# EasyEDA Pro project smart-car-main-board.eprj

# Schematic Schematic1
Board Name: Board1; Create Date: 2025-09-15; Page Name: P1; Project Name: 1; Schematic Name: Schematic1; Update Date: 2025-09-16; Company: 嘉立创EDA; Page Size: A4; Version: V1.0
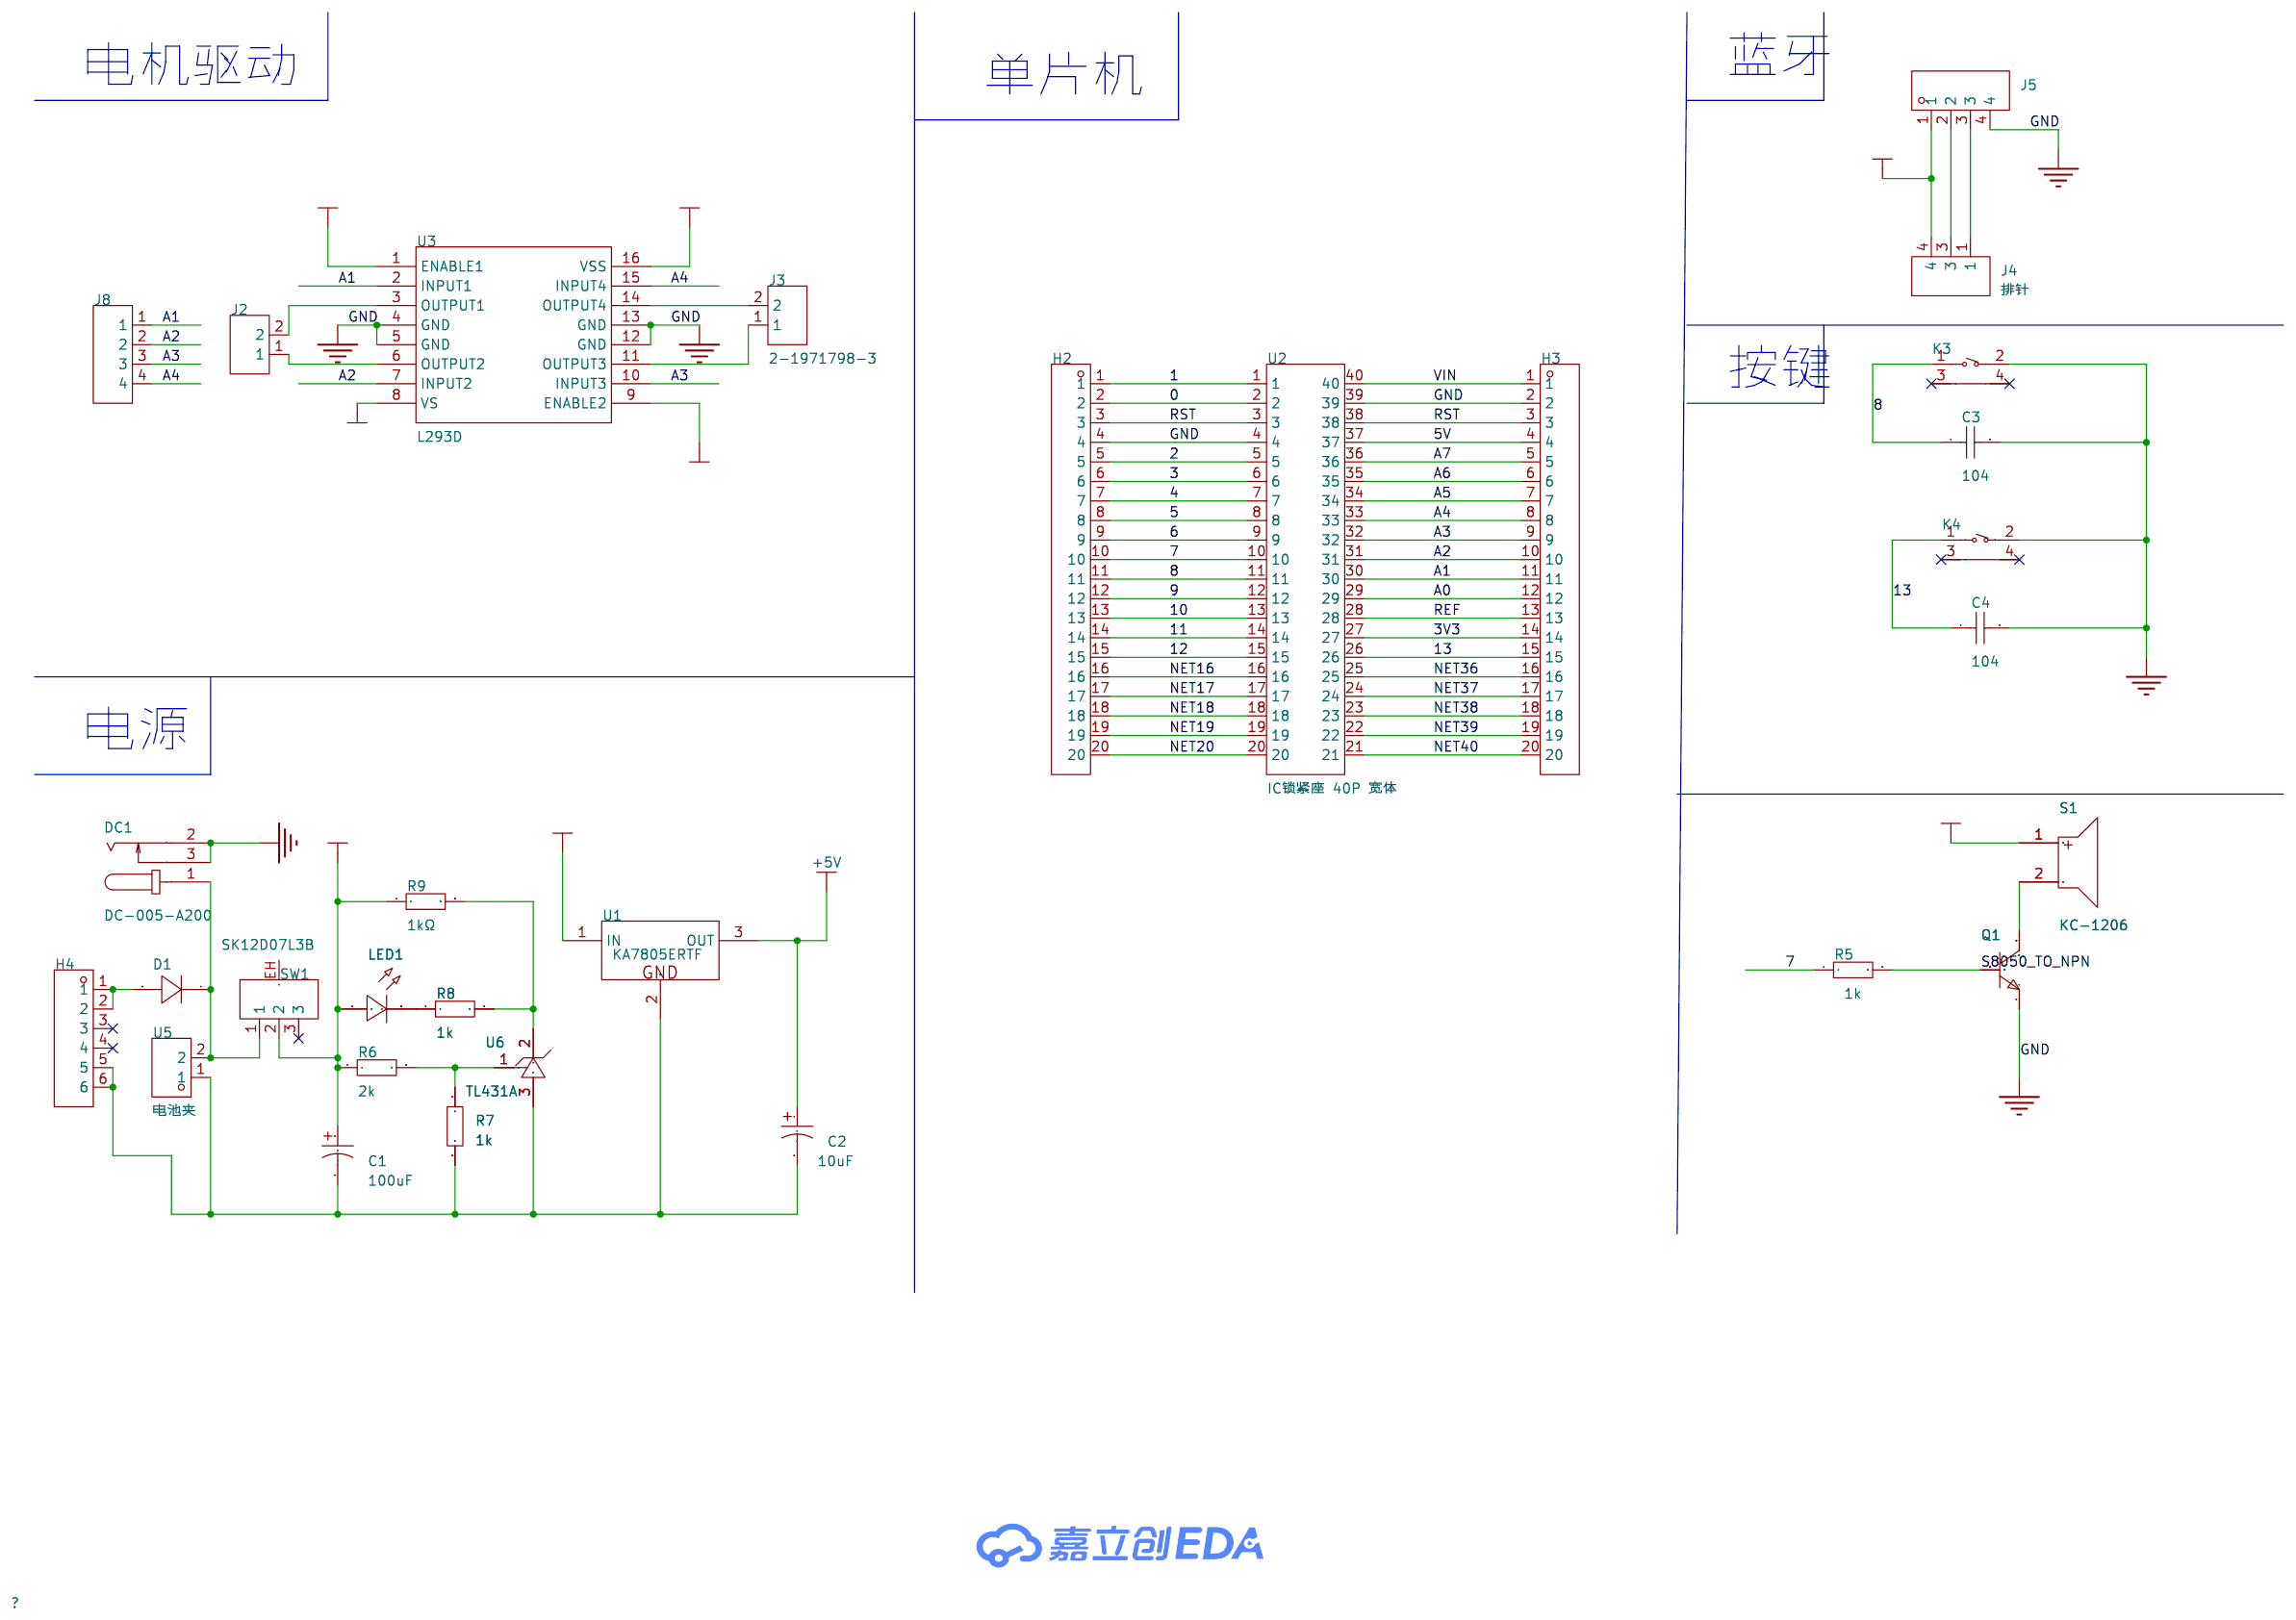
[diagram p0: schematic sheet]

## Parts
C1  100uF  [CAP-D5.0×F2.0]
C2  10uF  [CAP-D5.0×F2.0]
C3  104  [C-0.1]
C4  104  [C-0.1]
D1  -  [DO_1N4007]
DC1  DC-005-A200  [DC-IN-TH_DC-005-A200]
H2  -  [HDR-TH_20P-P2.54-V-M-1]
H3  -  [HDR-TH_20P-P2.54-V-M-1]
H4  -  [HDR-TH_6P-P2.54-V-F]
J2  2-1971798-3  [CONN-TH_2P-P5.08]
J3  2-1971798-3  [CONN-TH_2P-P5.08]
J4  排针  [HDR-TH_3P-P2.54-V-M_H254-1X3P]
J5  -  [HDR-TH_4P-P2.54-V-F]
J8  -  [HDR-TH_4P-P2.54-V-M]
K3  TC-6615-5-260G  [SW-TH_4P-L7.5-W5.0-P4.50]
K4  TC-6615-5-260G  [SW-TH_4P-L7.5-W5.0-P4.50]
LED1  -  [LED_TH-3mm]
Q1  -  [NPN（8050）]
R5  1k  [R_AXIAL-0.3]
R6  2k  [R_AXIAL-0.3]
R7  1k  [R_AXIAL-0.3]
R8  1k  [R_AXIAL-0.3]
R9  1kΩ  [R_AXIAL-0.3]
S1  KC-1206  [BUZ-TH_BD12.0-P6.50-D0.6-FD]
SW1  SK12D07L3B  [SW-TH_SK-12D07-X-X]
U1  KA7805ERTF  [7805]
U2  IC锁紧座 40P 宽体  [CONN-TH_40P-P2.54-V-R2-C20-S15.24-1]
U3  L293D  [DIP-16_L20.0-W6.4-P2.54-LS7.6-BL]
U5  电池夹  [CONN-TH_2P-P5.08]
U6  TL431A  [TO-92-3_L4.9-W3.7-P2.54-L-A]

## Library data of the parts
C1 C2 = CAP POL1: Published: 8-Jun-2000; LatestRevisionDate: 17-Jul-2002; LatestRevisionNote: Re-released for DXP Platform.; PackageReference: RB7.6-15; Publisher: Altium Limited; Comment: Cap Pol1
C3 C4 = CAP: Published: 8-Jun-2000; LatestRevisionDate: 17-Jul-2002; LatestRevisionNote: Re-released for DXP Platform.; PackageReference: RAD-0.3; Publisher: Altium Limited; Comment: Cap
D1 = D_1N4007A: Supplier Footprint: DO-41
DC1 = DC-005-A200: LCSC Part Name: DC电源插座 内径:2mm 外径:6.4mm; Supplier Part: C720557; Manufacturer: XUNPU(讯普); Supplier Footprint: 插件; Datasheet: https://item.szlcsc.com/datasheet/DC-005-A200/763564.html; Supplier: LCSC; Connector Type: DC电源插座; Mounting Type: 弯插; Inside Contact Diameter: 2mm; Outside Contact Diameter: 6.4mm; Current Rating: 3A; Voltage Rating (Max): 30V; Operating Temperature: -20℃~+70℃
H2 H3 = HDR-M_2.54_1x20P: Supplier Part: C50981; Supplier Footprint: 插件; JLCPCB Part Class: 扩展库
H4 = HDR-F_2.54_1x6P: Supplier Part: C40877; Supplier Footprint: 插件
J2 J3 = 2-1971798-3: Supplier Part: C9900011099; Supplier Footprint: DIP-1X2P-2.54MM(5.08X5.08); JLCPCB Part Class: 扩展库; Supplier: LCSC
J4 = H254-1X4P-P2NC-PA4-PS5-PB8-L17MM: Supplier Part: C9900152088; Supplier Footprint: 插件,P=2.54mm; JLCPCB Part Class: 扩展库; Supplier: LCSC
J5 = HDR-F_2.54_1x4P: Supplier Part: C2718488; Supplier Footprint: 插件
J8 = HDR-M_2.54_1x4P: Supplier Part: C492403; Supplier Footprint: 插件; JLCPCB Part Class: 扩展库
K3 K4 = TC-6615-5-260G: LCSC Part Name: 轻触6*6*5支架 插件260g; Supplier Part: C2845270; Manufacturer: HCTL(华灿天禄); Supplier Footprint: 插件; JLCPCB Part Class: 扩展库; Datasheet: https://atta.szlcsc.com/upload/public/pdf/source/20230523/3B07ECEFF69432C539FEAF1B55455C52.pdf; Supplier: LCSC; Circuit: 单刀单掷; Operating Force: 260gf; Mounting Style: 卧插; Switch Length: 6mm; Switch Width: 6mm; Switch Height: 5mm; Strike Gundam: 带支架; Contact Current: 50mA; Voltage Rating (DC): 12V
LED1 = LED_TH-R_3mm: Supplier Footprint: 插件
Q1 = S8050_TO_NPN: Supplier Footprint: TO-92
R5-R9 = Res_0603: Supplier Footprint: 0603
S1 = KC1206 16Ω: LCSC Part Name: 无源电磁式蜂鸣器; Supplier Part: C781869; Manufacturer: YUEXIN(悦馨); Supplier Footprint: 插件,D=12mm; JLCPCB Part Class: 扩展库; Datasheet: https://atta.szlcsc.com/upload/public/pdf/source/20200925/C781869_E6B371E803641AB17D3A1F9F38351C16.pdf; Supplier: LCSC; Driver Circuitry: 无源(外部驱动); Technology: 电磁式; Voltage - Supply: 1V~4V; Current Consumption: 30mA; Sound Pressure Level(SPL): 85dB; Diameter(φD): 12mm; Height: 10mm; Operating Temperature: -20℃~+85℃
SW1 = SK12D07L3B: LCSC Part Name: 2档侧拨可过回流焊手感极佳抗腐蚀24小时柄高3MM拨动开关SK-12D07-L3-B; Supplier Part: C480339; Manufacturer: XKB Connection(中国星坤); Supplier Footprint: 插件; JLCPCB Part Class: 扩展库; Datasheet: https://item.szlcsc.com/datasheet/SK12D07L3B/487802.html; Supplier: LCSC; Circuit: 单刀双掷; Actuator Style: 矩形柱状; Termination Style: PC引脚; Length: 8.6mm; Width: 4.5mm; Switch Height: 4.7mm; Actuator Color: 黑色; Current Rating: 300mA; Voltage Rating: 50V; Life: 1万次; Operating Temperature: -40℃~+85℃
U1 = KA7805ERTF: Supplier Part: C184462; Supplier Footprint: TO-252-2(DPAK); JLCPCB Part Class: 扩展库; Supplier: LCSC
U2 = IC锁紧座 40P 宽体: Supplier Part: C9900004833; Supplier Footprint: 插件; JLCPCB Part Class: 扩展库; Supplier: LCSC
U3 = L293D: LCSC Part Name: 600mA 有刷直流电机驱动芯片 36V; Supplier Part: C12340; Manufacturer: ST(意法半导体); Supplier Footprint: DIP-16; JLCPCB Part Class: 扩展库; Datasheet: https://atta.szlcsc.com/upload/public/pdf/source/20140724/1457707157802.pdf; Supplier: LCSC
U5 = KF2EDGK-5.08-2P: Supplier Part: C9900089420; Supplier Footprint: CONN-TH_2P-P5.08_DB2EVC-5.08-2P; JLCPCB Part Class: 扩展库; Supplier: LCSC
U6 = TL431A: Supplier Part: C411753; Manufacturer: PJSEMI(平晶微); Supplier Footprint: SOT-23; JLCPCB Part Class: 扩展库; Datasheet: https://atta.szlcsc.com/upload/public/pdf/source/20190819/C411753_12F949F6FF6688FC09D63250AB28F55F.pdf; Supplier: LCSC; Output Type: 可调; Voltage - Supply: 37V; Output Voltage: 2.495V~36V; Output Current: 100mA; Minimum Cathode Current for Regulation: 1mA

## Nets
3V3: H3.14 J4.4 J5.1 U2.27
5V: H3.4 U2.37
+5V: C2.1 U1.3(OUT)
+VCC: C1.1 LED1.1(C) R6.1 R9.1 SW1.2 U1.1(IN) U3.8(VS)
GND: C3.2 C4.2 DC1.2 DC1.3 H2.4 H3.2 J5.4 K3.2 K4.2 Q1.1(E) U2.4 U2.39 U3.4(GND) U3.5(GND) U3.12(GND) U3.13(GND)
VIN: H3.1 U2.40
0: H2.2 U2.2
1: H2.1 U2.1
2: H2.5 U2.5
3: H2.6 U2.6
4: H2.7 U2.7
5: H2.8 U2.8
6: H2.9 U2.9
7: H2.10 R5.1 U2.10
8: C3.1 H2.11 K3.1 U2.11
9: H2.12 U2.12
10: H2.13 U2.13
11: H2.14 U2.14
12: H2.15 U2.15
13: C4.1 H3.15 K4.1 U2.26
+5: S1.1 U3.1(ENABLE1) U3.9(ENABLE2) U3.16(VSS)
A0: H3.12 U2.29
A1: H3.11 J8.1 U2.30 U3.2(INPUT1)
A2: H3.10 J8.2 U2.31 U3.7(INPUT2)
A3: H3.9 J8.3 U2.32 U3.10(INPUT3)
A4: H3.8 J8.4 U2.33 U3.15(INPUT4)
A5: H3.7 U2.34
A6: H3.6 U2.35
A7: H3.5 U2.36
NET16: H2.16 U2.16
NET17: H2.17 U2.17
NET18: H2.18 U2.18
NET19: H2.19 U2.19
NET20: H2.20 U2.20
NET36: H3.16 U2.25
NET37: H3.17 U2.24
NET38: H3.18 U2.23
NET39: H3.19 U2.22
NET40: H3.20 U2.21
REF: H3.13 U2.28
RST: H2.3 H3.3 U2.3 U2.38
S8050_TO_NPN: Q1.2(B) R5.2
$1N1657: J2.1 U3.6(OUTPUT2)
$1N1660: J2.2 U3.3(OUTPUT1)
$1N3874: J4.1 J5.3
$1N4302: Q1.3(C) S1.2
Net-(C1-2): C1.2 C2.2 H4.5 H4.6 R7.1 U1.2(GND) U5.1 U6.3(A)
Net-(D1-1): D1.1(K) DC1.1 SW1.1 U5.2
Net-(D1-2): D1.2(A) H4.1 H4.2
Net-(J3-1): J3.1 U3.11(OUTPUT3)
Net-(J3-2): J3.2 U3.14(OUTPUT4)
Net-(J4-3): J4.3 J5.2
Net-(LED1-2): LED1.2(A) R8.1
Net-(R6-2): R6.2 R7.2 U6.1(R)
Net-(R8-2): R8.2 R9.2 U6.2(K)

Not connected (* = marked no-connect by the designer): H4 3* 4*; K3 3* 4*; K4 3* 4*; SW1 3* EH

## Notes on the sheet
- 电机驱动
- 蓝牙
- 单片机
- 按键
- 电源

# Board PCB1
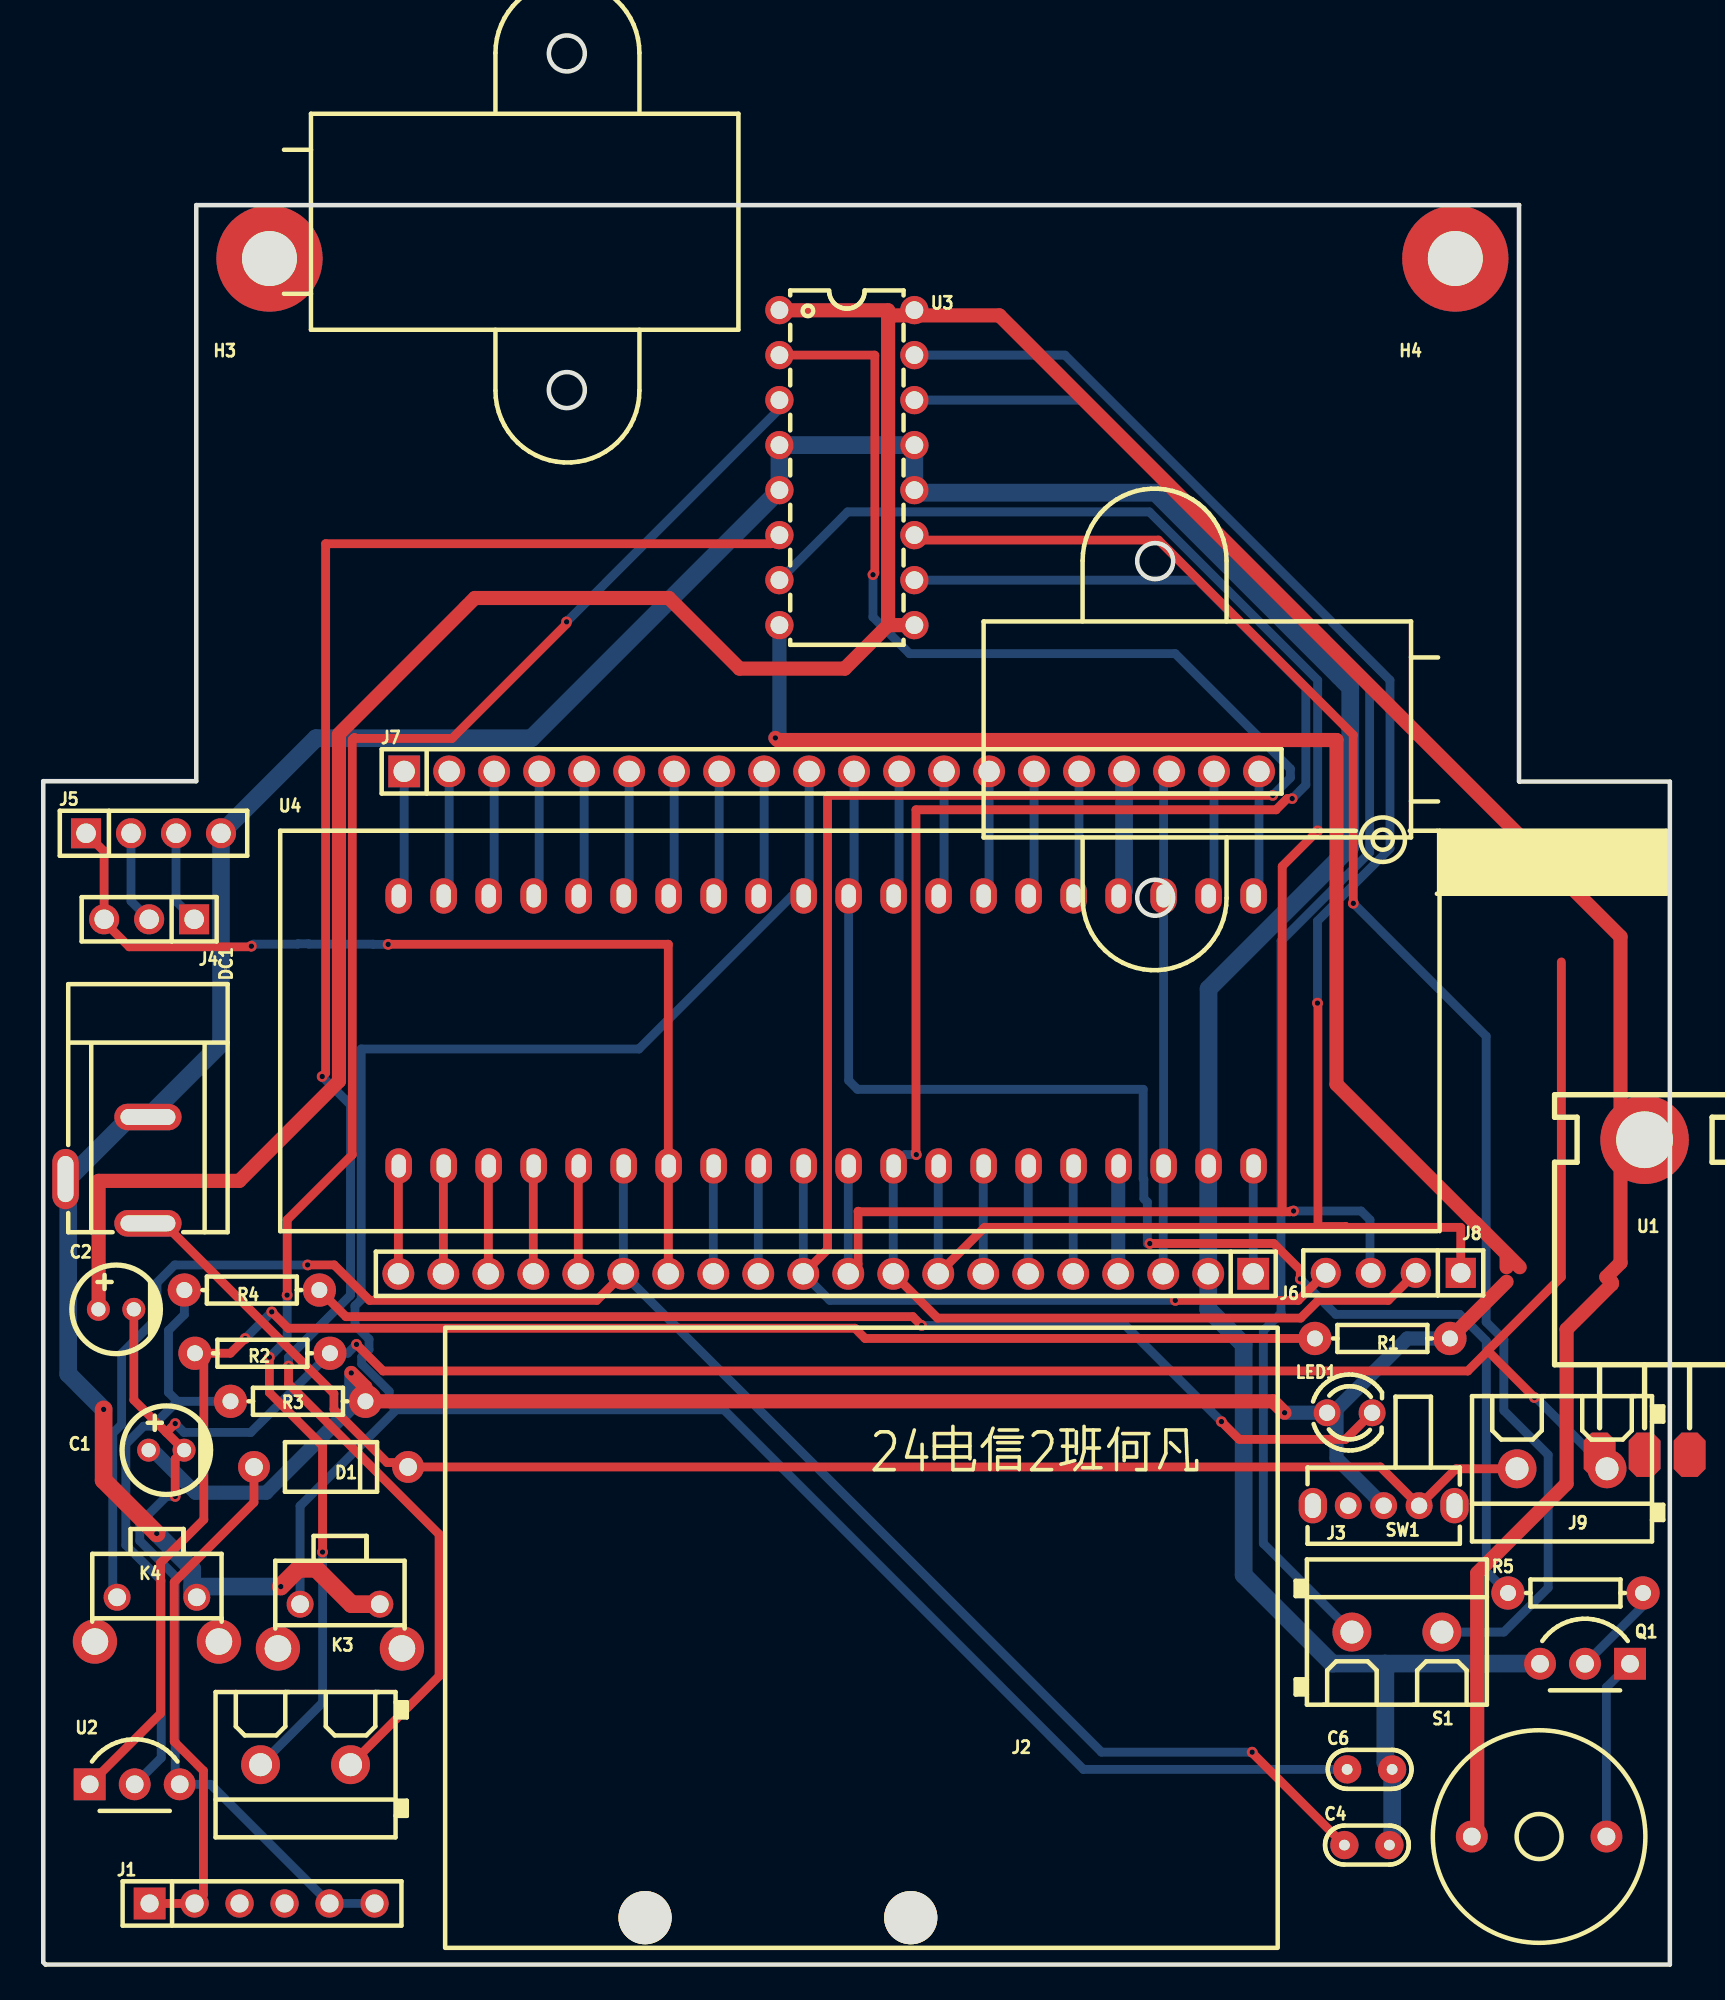
[diagram p1: board, top side]
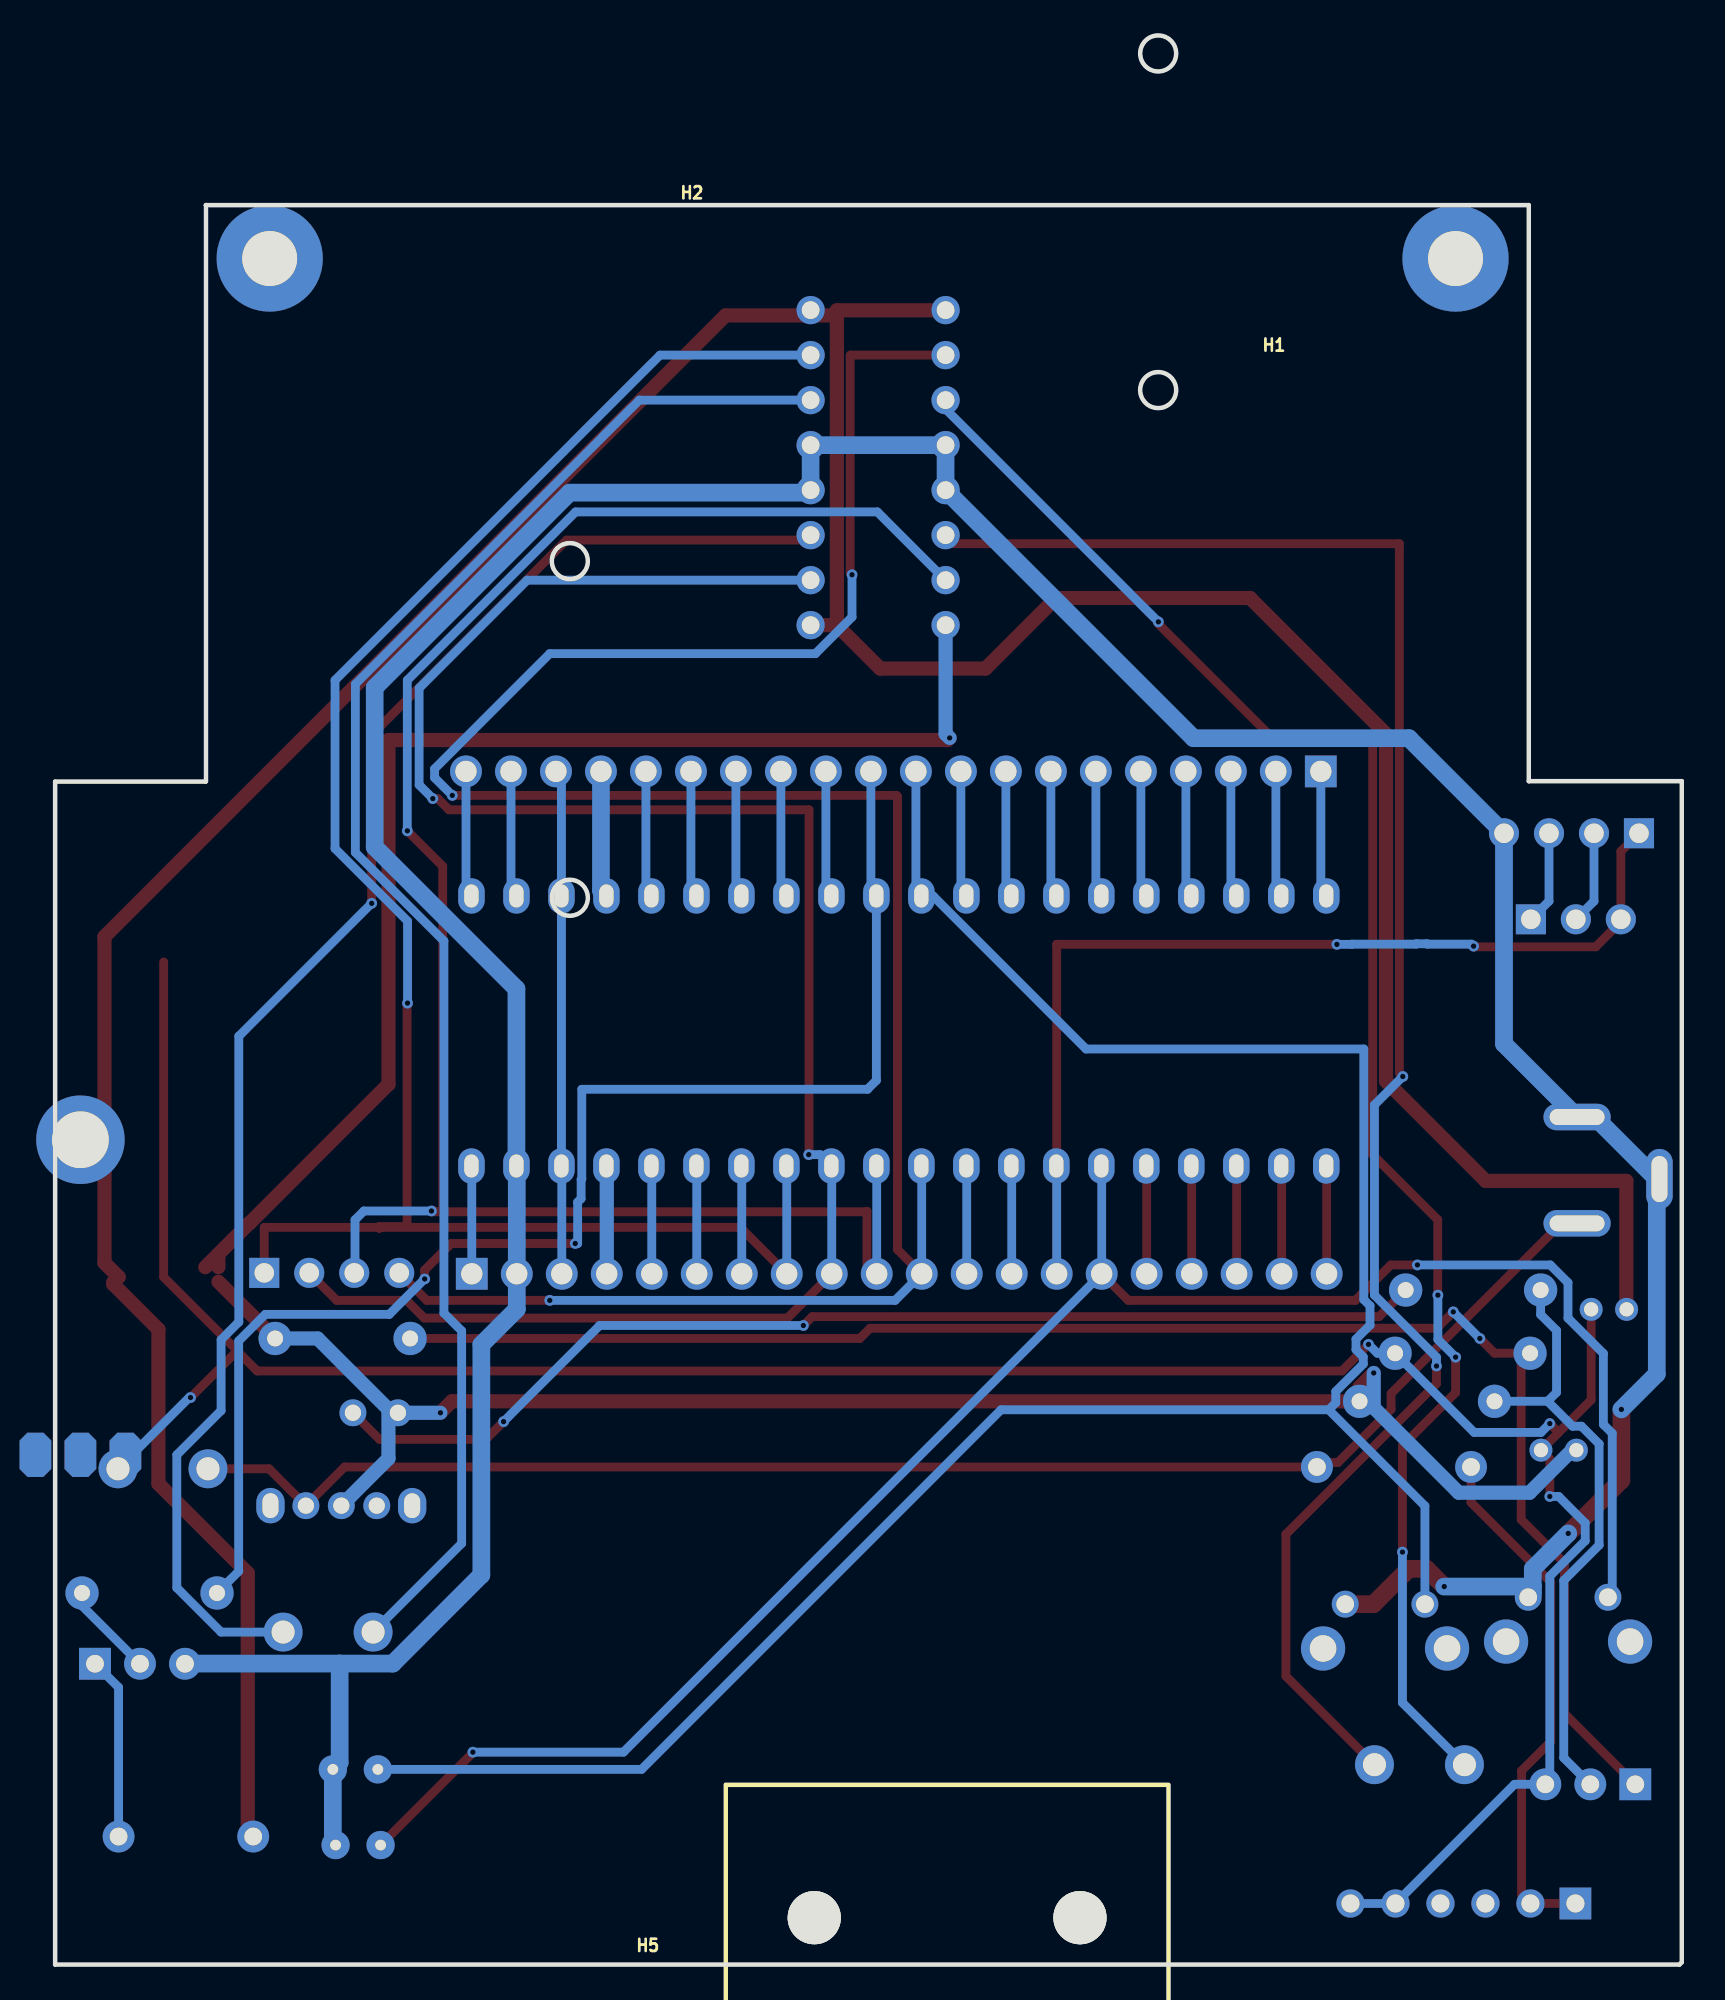
[diagram p2: board, bottom side, seen from below]

Outline 91.83 x 108.88 mm; copper layers: Top Layer, Bottom Layer. Coordinates in mm from the lower left corner of the outline.
Outline path: 0,66.79 0,0.13 0.13,0 91.83,0 91.83,66.76 83.34,66.76 83.31,66.79 83.31,99.3 8.64,99.3 8.64,66.79 0,66.79
Stack: Top Layer 0.035mm / Dielectric1 1.51mm FR4 er 4.5 / Bottom Layer 0.035mm

## Design rules (mm)
template: 自定义配置
spacing copperThickness1oz (default): track to track 0.102, other pairs 0.152 to 0.3
spacing copperThickness2oz: track to track 0.203, other pairs 0.152 to 0.3
track width copperThickness1oz: min 0.127, default 0.254, max 2.54
track width copperThickness2oz: min 0.203, default 0.254, max 2.54
track width 1 (default): min 0.127, default 0.5, max 2.54
track width VCC: min 0.127, default 0.8, max 2.54
track width gnd: min 0.127, default 1, max 2.54
differential pair differentialPair (default): width min 0.127, default 0.254, max 2.54; gap min 0.152, default 0.152
via viaSize (default): diameter min 0.5, default 0.61, max 10; hole min 0.3, default 0.305, max 6.3
net +5 uses VCC
net GND uses gnd
net 5V uses VCC
net GNO uses gnd
net +VCC uses VCC

## Placement (name value [footprint] x y rotation side)
C1  100uF  [CAP-D5.0-F2.0]  6.95 29.03 0 top
C2  10uF  [CAP-D5.0-F2.0]  4.11 36.98 0 top
C4  104  [C-0.1]  73.45 6.74 0 top
C6  104  [C-0.1]  73.61 11.02 0 top
D1  IN4007  [DO_1N4007]  16.25 28.08 180 top
DC1  DC-005-A200  [DC-IN-TH_DC-005-A200]  3.58 44.83 270 top
H1  -  [DJ]  25.91 93.53 180 bottom
H2  -  [DJ]  66.42 74.53 0 bottom
H3  -  [HOLE]  12.52 95.52 0 top
H4  -  [HOLE]  79.46 95.52 0 top
H5  -  [WXL]  53.97 10.15 180 bottom
J1  -  [HDR-TH_6P-P2.54-V-F]  12.35 3.45 0 top
J2  2-1971798-3  [CONN-TH_2P-P5.08]  14.81 11.28 180 top
J3  2-1971798-3  [CONN-TH_2P-P5.08]  76.42 18.77 0 top
J4  排针  [HDR-TH_3P-P2.54-V-M]  5.98 58.99 180 top
J5  -  [HDR-TH_4P-P2.54-V-F]  6.22 63.85 0 top
J6  -  [HDR-TH_20P-P2.54-V-M-1]  44.18 38.99 180 top
J7  -  [HDR-TH_20P-P2.54-V-M-1]  44.5 67.34 0 top
J8  -  [HDR-TH_4P-P2.54-V-M]  76.21 39.04 180 top
J9  -  [CONN-TH_2P-P5.08]  85.74 27.98 180 top
K3  TC-6615-5-260G  [SW-TH_4P-L7.5-W5.0-P4.50]  16.75 19.09 0 top
K4  TC-6615-5-260G  [SW-TH_4P-L7.5-W5.0-P4.50]  6.42 19.48 0 top
LED1  -  [LED_TH-3mm]  73.75 31.14 0 top
Q1  S8050_TO_NPN  [NPN（8050）]  87.04 16.98 0 top
R1  2kΩ  [R_AXIAL-0.3]  75.6 35.34 180 top
R2  1kΩ  [R_AXIAL-0.3]  12.37 34.5 180 top
R3  1kΩ  [R_AXIAL-0.3]  14.38 31.79 180 top
R4  1kΩ  [R_AXIAL-0.3]  11.78 38.07 180 top
R5  1k  [R_AXIAL-0.3]  86.5 20.97 0 top
S1  KC-1206  [BUZ-TH_BD12.0-P7.60-D0.6-FD]  84.45 7.23 0 top
SW1  SK12D07L3B  [SW-TH_SK-12D07-X-X]  75.67 25.9 180 top
U1  KA7805ERTF  [7805]  83.16 38.8 0 top
U2  IC锁紧座 40P 宽体  [TO-92-3_L4.9-W3.7-P2.54-L-A]  5.16 10.17 0 top
U3  L293D  [DIP-16_L20.0-W6.4-P2.54-LS7.6-BL]  45.37 84.48 270 top
U4  IC锁紧座 40P 宽体  [CONN-TH_40P-P2.54-V-R2-C20-S15.24-1]  44.2 52.69 0 top

## Footprints (pads in the part's own frame, mm; a bottom-side part is the same pattern mirrored in y, then rotated)
7805
  custom 1.8x2.5 hole 1: 1(4.699,-10.033) 2(7.239,-10.033) 3(9.779,-10.033)
  round 5 hole 3.2: 2(7.239,7.747)
BUZ-TH_BD12.0-P7.60-D0.6-FD
  round 1.8 hole 1: 1(-3.8,0) 2(3.8,0)
C-0.1
  round 1.6 hole 0.605x0.6: 1(0,0) 2(2.54,0)
CAP-D5.0-F2.0
  round 1.3 hole 0.8: 1(-1,0) 2(1,0)
CONN-TH_2P-P5.08
  round 2.2 hole 1.3: 1(-2.54,0) 2(2.54,0)
CONN-TH_40P-P2.54-V-R2-C20-S15.24-1
  oval 1.5x2 hole 0.8x1.3: 1(24.13,7.62) 2(21.59,7.62) 3(19.05,7.62) 4(16.51,7.62) 5(13.97,7.62) 6(11.43,7.62) 7(8.89,7.62) 8(6.35,7.62) 9(3.81,7.62) 10(1.27,7.62) 11(-1.27,7.62) 12(-3.81,7.62) 13(-6.35,7.62) 14(-8.89,7.62) 15(-11.43,7.62) 16(-13.97,7.62) 17(-16.51,7.62) 18(-19.05,7.62) 19(-21.59,7.62) 20(-24.13,7.62) 21(-24.13,-7.62) 22(-21.59,-7.62) 23(-19.05,-7.62) 24(-16.51,-7.62) 25(-13.97,-7.62) 26(-11.43,-7.62) 27(-8.89,-7.62) 28(-6.35,-7.62) 29(-3.81,-7.62) 30(-1.27,-7.62) 31(1.27,-7.62) 32(3.81,-7.62) 33(6.35,-7.62) 34(8.89,-7.62) 35(11.43,-7.62) 36(13.97,-7.62) 37(16.51,-7.62) 38(19.05,-7.62) 39(21.59,-7.62) 40(24.13,-7.62)
DC-IN-TH_DC-005-A200
  oval 1.5x3.8 hole 0.9x3.1: 1(3,2.325) 2(-3,2.325)
  oval 3.4x1.5 hole 2.6x0.9: 3(0.5,-2.325)
DIP-16_L20.0-W6.4-P2.54-LS7.6-BL
  round 1.6 hole 1: 1(-8.89,-3.81) 2(-6.35,-3.81) 3(-3.81,-3.81) 4(-1.27,-3.81) 5(1.27,-3.81) 6(3.81,-3.81) 7(6.35,-3.81) 8(8.89,-3.81) 9(8.89,3.81) 10(6.35,3.81) 11(3.81,3.81) 12(1.27,3.81) 13(-1.27,3.81) 14(-3.81,3.81) 15(-6.35,3.81) 16(-8.89,3.81)
DJ
  round 0.003 hole 2.032: 1(-3.649,14.326) 2(-3.649,-4.674)
DO_1N4007
  round 1.8 hole 1: 1(-4.35,0) 2(4.35,0)
HDR-TH_3P-P2.54-V-M
  rect 1.7x1.7 hole 1.1: 1(-2.54,0)
  round 1.7 hole 1.1: 2(0,0) 3(2.54,0)
HDR-TH_4P-P2.54-V-F
  rect 1.7x1.7 hole 1.1: 1(-3.81,0)
  round 1.7 hole 1.1: 2(-1.27,0) 3(1.27,0) 4(3.81,0)
HDR-TH_4P-P2.54-V-M
  rect 1.7x1.7 hole 1.1: 1(-3.81,0)
  round 1.7 hole 1.1: 2(-1.27,0) 3(1.27,0) 4(3.81,0)
HDR-TH_6P-P2.54-V-F
  rect 1.8x1.8 hole 1.02: 1(-6.35,0)
  round 1.6 hole 1.02: 2(-3.81,0) 3(-1.27,0) 4(1.27,0) 5(3.81,0) 6(6.35,0)
HDR-TH_20P-P2.54-V-M-1
  rect 1.8x1.8 hole 1.2: 1(-24.13,0)
  round 1.8 hole 1.2: 2(-21.59,0) 3(-19.05,0) 4(-16.51,0) 5(-13.97,0) 6(-11.43,0) 7(-8.89,0) 8(-6.35,0) 9(-3.81,0) 10(-1.27,0) 11(1.27,0) 12(3.81,0) 13(6.35,0) 14(8.89,0) 15(11.43,0) 16(13.97,0) 17(16.51,0) 18(19.05,0) 19(21.59,0) 20(24.13,0)
HOLE
  round 6 hole 3.1: 1(0.254,0.762)
LED_TH-3mm
  round 1.524 hole 0.914: 1(-1.27,0) 2(1.27,0)
NPN（8050）
  round 1.8 hole 1: 1(-2.54,0) 2(0,0)
  rect 1.8x1.8 hole 1: 3(2.54,0)
R_AXIAL-0.3
  round 1.879 hole 0.899: 1(-3.81,0) 2(3.81,0)
SW-TH_4P-L7.5-W5.0-P4.50
  round 1.524 hole 1: 1(-2.25,1.25) 2(2.25,1.25)
  round 2.5 hole 1.5: 3(-3.5,-1.25) 4(3.5,-1.25)
SW-TH_SK-12D07-X-X
  round 1.524 hole 0.914: 1(-2,0) 2(0,0) 3(2,0)
  oval 1.6x2 hole 0.9x1.4: EH(-4,0) EH(4,0)
TO-92-3_L4.9-W3.7-P2.54-L-A
  rect 1.8x1.8 hole 1: 1(-2.54,0)
  round 1.8 hole 1: 2(0,0) 3(2.54,0)
WXL
  round 3 hole 3: 1(5,-7.5) 2(20,-7.5)

## Nets
3V3: J4.3 J5.1 J6.14 U4.27
5V: J6.4 U4.37
+VCC: C1.1 LED1.1 R1.1 R3.1 SW1.2 U1.1 U3.8
GND: C4.2 C6.2 DC1.2 DC1.3 J5.4 J6.2 K3.2 K4.2 Q1.1 U3.4 U3.5 U3.12 U3.13 U4.39
VIN: J6.1 U4.40
0: J7.19 U4.2
1: J7.20 U4.1
2: J7.16 U4.5
3: J7.15 U4.6
4: J7.14 U4.7
5: J7.13 U4.8
6: J7.12 U4.9
7: J7.11 R5.1 U4.10
8: C6.1 J7.10 K3.1 U4.11
9: J7.9 U4.12
10: J7.8 U4.13
11: J7.7 U4.14
12: J7.6 U4.15
13: C4.1 J6.15 K4.1 U4.26
+5: C2.1 S1.1 U1.3 U3.1 U3.9 U3.16
A0: J6.12 U4.29
A1: J6.11 J8.4 U3.2 U4.30
A2: J6.10 J8.3 U3.7 U4.31
A3: J6.9 J8.2 U3.10 U4.32
A4: J6.8 J8.1 U3.15 U4.33
A5: J6.7 U4.34
A6: J6.6 U4.35
A7: J6.5 U4.36
GNO: J7.17 U4.4
NET16: J7.5 U4.16
NET17: J7.4 U4.17
NET18: J7.3 U4.18
NET19: J7.2 U4.19
NET20: J7.1 U4.20
NET36: J6.16 U4.25
NET37: J6.17 U4.24
NET38: J6.18 U4.23
NET39: J6.19 U4.22
NET40: J6.20 U4.21
REF: J6.13 U4.28
RST: J6.3 J7.18 U4.3 U4.38
$1N1657: J2.1 U3.6
$1N1660: J2.2 U3.3
$1N1764: J3.1 U3.14
$1N1768: J3.2 U3.11
$1N2012: C1.2 C2.2 J1.5 J1.6 J9.1 R2.1 U1.2 U2.3
$1N2121: D1.1 DC1.1 J9.2 SW1.1
$1N2436: R1.2 R2.2 U2.1
$1N2448: R3.2 R4.2 U2.2
$1N2454: LED1.2 R4.1
$1N2831: D1.2 J1.1 J1.2
$1N3869: J4.2 J5.2
$1N3874: J4.1 J5.3
$1N4294: Q1.2 R5.2
$1N4302: Q1.3 S1.2

Pads without a net: H1 1 2; H2 1 2; H3 1; H4 1; H5 1 2; J1 3 4; K3 3 4; K4 3 4; SW1 3 EH

## Via types
v1: diameter 0.61, hole 0.305, Top Layer to Bottom Layer, 35 vias

## Routing (per net, layer and track width the routed paths; a pad name or vN(x,y) marks a point on that pad's centre or on a via; arc(x,y) is an arc through that point)
3V3: length 62.6
  Top Layer w0.5: v1(19.47,57.58) 19.47,57.58 35.29,57.58 J6.14 ; J5.1 3.44,62.83 J4.3 3.44,58.86 4.85,57.44 11.71,57.44 v1(11.75,57.48)
  Bottom Layer w0.5: 35.31,45.07 35.29,45.05 J6.14 ; v1(19.47,57.58) 18.63,57.58 18.62,57.59 15,57.59 14.97,57.61 14.39,57.61 14.36,57.59 11.86,57.59 v1(11.75,57.48)
5V: length 6.1
  Bottom Layer w0.8: U4.37 60.69,45.05 J6.4
+VCC: length 165.6
  Top Layer w0.8: 83.35,39.36 80.87,41.84 80.85,41.84 73.01,49.68 73.01,69.11 41.45,69.11 v1(41.33,69.23) ; 82.61,39.36 82.61,40.08 ; v1(70.08,31.14) 69.43,31.79 R3.1 18.19,32.59 v1(17.39,33.39) ; R1.1 82.61,38.54
  Bottom Layer w0.8: 73.01,31.34 73.01,28.56 SW1.2 ; 73.01,31.34 77.01,35.34 R1.1 ; 73.01,31.34 72.67,31.34 LED1.1 v1(70.08,31.14) ; v1(17.39,33.39) 17.39,31.43 12.59,26.63 8.59,26.63 6.19,29.03 C1.1 ; U3.8 41.56,69.46 v1(41.33,69.23)
GND: length 227.2
  Top Layer w1: 19,20.34 17.4,20.34 15.41,22.33 14.41,22.33 v1(13.41,21.33) ; v1(3.41,31.33) 3.41,27.33 v1(6.41,24.33)
  Bottom Layer w1: C4.2 76.15,6.9 C6.2 75.77,11.4 75.77,16.99 ; v1(3.41,31.33) 1.41,33.33 1.41,44.33 ; v1(6.41,24.33) 8.41,22.33 8.41,21.33 ; 8.41,21.33 v1(13.41,21.33) ; 8.41,21.33 8.41,20.99 K4.2 ; 75.77,16.99 72.77,16.99 67.77,21.99 67.77,34.99 65.77,36.99 J6.2 65.77,45.05 U4.39 65.79,55.07 73.79,63.07 73.79,72.07 62.79,83.07 49.32,83.07 U3.12 U3.13 U3.4 U3.5 27.56,69.21 15.4,69.21 J5.4 10.03,51.96 DC1.2 4.91,47.83 1.41,44.33 ; 75.77,16.99 84.49,16.99 Q1.1 ; 1.41,44.33 DC1.3
VIN: length 6.1
  Bottom Layer w0.5: U4.40 68.31,45.05 J6.1
0: length 7.2
  Bottom Layer w0.5: U4.2 66.09,60.62 J7.19
1: length 7.2
  Bottom Layer w0.5: U4.1 68.63,60.62 J7.20
2: length 7.2
  Bottom Layer w0.5: U4.5 58.47,60.62 J7.16
3: length 7.2
  Bottom Layer w0.5: J7.15 55.93,60.62 U4.6
4: length 7.2
  Bottom Layer w0.5: J7.14 53.39,60.62 U4.7
5: length 7.2
  Bottom Layer w0.5: U4.8 50.85,60.62 J7.13
6: length 7.2
  Bottom Layer w0.5: U4.9 48.31,60.62 J7.12
7: length 79.6
  Top Layer w0.5: v1(70.97,38.69) 70.97,39.19 69.47,40.69 v1(62.47,40.69)
  Bottom Layer w0.5: v1(70.97,38.69) 72.97,36.69 79.97,36.69 81.47,35.19 81.47,22.19 R5.1 ; v1(62.47,40.69) 62.33,40.69 62.33,43.03 62.13,43.23 62.13,44.3 62.09,44.34 62.09,49.4 45.97,49.4 45.47,49.9 45.47,60.31 45.77,60.62 J7.11
8: length 132.8
  Bottom Layer w0.5: 14.5,20.34 14.5,25.88 19.93,31.31 ; 19.93,31.31 19.53,31.71 19.53,32.34 17.98,33.9 17.98,34.29 18.39,34.71 18.39,35.29 17.6,36.09 17.6,37.18 17.95,37.53 17.95,51.67 33.63,51.67 42.27,60.31 U4.11 43.23,60.62 J7.10 ; 19.93,31.31 38.43,31.31 58.72,11.02 C6.1
9: length 7.2
  Bottom Layer w0.5: J7.9 40.69,60.62 U4.12
10: length 7.2
  Bottom Layer w0.5: J7.8 38.15,60.62 U4.13
11: length 7.2
  Bottom Layer w0.5: J7.7 35.61,60.62 35.31,60.31
12: length 7.2
  Bottom Layer w0.5: U4.15 33.07,60.62 J7.6
13: length 107.3
  Top Layer w0.5: v1(68.25,11.99) 68.25,11.95 C4.1 ; v1(14.92,39.49) 16.42,39.49 18.42,37.49 31.25,37.49 J6.15
  Bottom Layer w0.5: v1(68.25,11.99) 59.75,11.99 J6.15 32.75,45.05 U4.26 ; K4.1 3.92,20.97 3.92,29.99 4.42,30.49 4.42,34.49 6.42,36.49 6.42,38.49 7.42,39.49 v1(14.92,39.49)
+5: length 215.6
  Top Layer w0.8: 47.7,75.59 U3.9 ; 47.7,75.59 47.7,93.08 ; 47.7,75.59 45.25,73.14 39.31,73.14 35.32,77.13 24.37,77.13 16.69,69.45 ; 47.7,93.08 47.7,93.36 41.57,93.36 U3.1 ; 47.7,93.08 49.18,93.08 ; 16.69,69.42 16.69,49.86 11.07,44.23 3.13,44.23 3.13,36.99 C2.1 ; 49.18,93.08 U3.16 ; 49.18,93.08 53.98,93.08 89.04,58.01 89.04,39.6 88.24,38.8 88.55,38.5 88.55,38.4 86,35.85 86,27.14 80.95,22.1 80.95,7.53 S1.1
A0: length 6.1
  Bottom Layer w0.5: J6.12 40.37,45.05 U4.29
A1: length 138.8
  Top Layer w0.5: J8.4 70.85,37.49 v1(63.91,37.49) ; v1(69.41,65.99) 44.33,65.99 44.27,65.93 44.27,40.35 J6.11 ; v1(46.84,78.44) 46.95,78.55 46.95,90.82 46.93,90.83 U3.2
  Bottom Layer w0.5: v1(69.41,65.99) 70.41,66.99 70.41,67.49 63.91,73.99 48.91,73.99 46.84,76.05 v1(46.84,78.44) ; U4.30 42.91,45.05 J6.11 44.41,37.49 v1(63.91,37.49)
A2: length 108.8
  Top Layer w0.5: 45.45,38.97 46,39.52 46,42.51 46.04,42.47 ; 69.95,42.49 70.37,42.49 70.42,42.53 v1(70.58,42.53) ; 69.95,42.49 69.95,61.99 v1(71.95,63.99) ; 69.95,42.49 46.04,42.49
  Bottom Layer w0.5: v1(70.58,42.53) 74.4,42.53 74.9,42.03 74.9,39.08 J8.3 ; 41.56,78.13 45.41,81.99 62.45,81.99 71.95,72.49 v1(71.95,63.99) ; 45.47,45.07 45.45,45.05 J6.10
A3: length 111.3
  Top Layer w0.5: J6.9 50.49,36.49 70.99,36.49 71.99,37.49 75.93,37.49 J8.2 ; v1(70.51,65.81) 70.23,65.81 69.59,65.17 49.27,65.17 49.27,45.87 49.22,45.83
  Bottom Layer w0.5: J6.9 47.99,45.05 U4.32 48.64,45.71 v1(49.29,45.71) ; v1(70.51,65.81) 71.28,66.58 71.28,72.03 65.18,78.13 49.18,78.13
A4: length 108
  Top Layer w0.5: 73.48,41.61 73.53,41.65 ; 73.48,41.61 53.15,41.61 J6.8 ; 73.48,41.61 73.53,41.56 ; 73.53,41.65 73.53,41.56 ; 73.53,41.65 71.98,41.65 71.96,41.67 71.96,54.24 v1(71.93,54.26) ; 73.53,41.56 73.57,41.61 80.02,41.61 J8.1
  Bottom Layer w0.5: v1(71.93,54.26) 71.93,58.89 76.03,62.99 76.03,72.49 57.68,90.83 U3.15 ; J6.8 50.53,45.05 U4.33
A5: length 6.1
  Bottom Layer w0.5: J6.7 53.07,45.05 U4.34
A6: length 6.1
  Bottom Layer w0.5: U4.35 55.61,45.05 J6.6
A7: length 6.1
  Bottom Layer w0.5: U4.36 58.15,45.05 J6.5
GNO: length 7.2
  Bottom Layer w1: U4.4 61.01,60.62 J7.17
NET16: length 7.2
  Bottom Layer w0.5: U4.16 30.53,60.62 J7.5
NET17: length 7.2
  Bottom Layer w0.5: U4.17 27.99,60.62 J7.4
NET18: length 7.2
  Bottom Layer w0.5: 25.15,60.31 25.45,60.62 J7.3
NET19: length 7.2
  Bottom Layer w0.5: J7.2 22.91,60.62 U4.19
NET20: length 7.2
  Bottom Layer w0.5: J7.1 20.37,60.62 20.07,60.31
NET36: length 6.1
  Top Layer w0.5: U4.25 30.21,45.05 J6.16
NET37: length 6.1
  Top Layer w0.5: J6.17 27.67,45.05 U4.24
NET38: length 6.1
  Top Layer w0.5: 25.15,45.07 25.13,45.05 J6.18
NET39: length 6.1
  Top Layer w0.5: J6.19 22.59,45.05 U4.22
NET40: length 6.1
  Top Layer w0.5: J6.20 20.05,45.05 20.07,45.07
REF: length 6.1
  Bottom Layer w0.5: J6.13 37.83,45.05 U4.28
RST: length 28.5
  Bottom Layer w0.5: J6.3 63.23,45.05 63.25,45.07 63.25,67.03 J7.18
$1N1657: length 102.5
  Top Layer w0.5: v1(15.75,50.12) 15.94,50.32 15.94,80.19 41.07,80.19 U3.6 ; v1(13.85,33.78) 13.85,32.78 22.35,24.28 22.35,16.28 J2.1
  Bottom Layer w0.5: v1(15.75,50.12) 17.35,48.52 17.35,37.78 13.85,34.28 v1(13.85,33.78)
$1N1660: length 94.9
  Top Layer w0.5: 17.57,69.26 17.52,69.22 17.45,69.14 17.45,45.71 13.77,42.04 13.77,37.79 v1(13.77,37.78) ; 17.63,69.2 23.08,69.2 29.54,75.67 v1(29.54,75.78) ; v1(12.77,34.28) 12.77,32.28 15.77,29.28 v1(15.77,23.28)
  Bottom Layer w0.5: v1(12.77,34.28) 13.77,35.28 v1(13.77,37.78) ; v1(29.54,75.78) 41.56,87.79 U3.3 ; J2.2 15.77,14.78 v1(15.77,23.28)
$1N1764: length 90.4
  Bottom Layer w0.5: J3.1 68.88,23.77 68.88,35.77 69.88,36.77 69.88,57.77 74.88,62.77 74.88,72.27 58.85,88.29 U3.14
$1N1768: length 89.2
  Top Layer w0.5: v1(73.96,59.89) 73.96,69.39 62.96,80.39 49.46,80.39 U3.11
  Bottom Layer w0.5: v1(73.96,59.89) 81.46,52.39 81.46,36.27 82.46,35.27 82.46,31.27 84.96,28.77 84.96,21.27 82.46,18.77 J3.2
$1N2012: length 155.4
  Top Layer w0.5: 81.54,34.64 81.54,34.62 80.42,33.5 19.18,33.5 v1(17.68,35) ; 81.54,34.64 v1(84.18,32) ; 81.54,34.64 85.7,38.8 85.7,56.58 ; 6.95,30.03 v1(7.45,30.53) ; 6.95,30.03 5.11,31.87 C2.2 ; 6.95,30.03 C1.2 7.45,28.53 v1(7.45,26.42)
  Bottom Layer w0.5: J9.1 84.26,32 v1(84.18,32) ; J1.6 J1.5 9.44,10.17 7.7,10.17 7.45,10.43 7.45,21.92 5.45,23.92 5.45,24.92 6.95,26.42 v1(7.45,26.42) ; v1(7.45,30.53) 7.95,30.03 11.71,30.03 R2.1 17.18,34.5 v1(17.68,35)
$1N2121: length 85.3
  Top Layer w0.5: DC1.1 6.8,41.83 16.41,32.23 16.41,31.33 19.41,28.33 20.35,28.33 D1.1 75.49,28.08 SW1.1 79.75,27.98 J9.2
$1N2436: length 92
  Top Layer w0.5: v1(12.9,36.84) 13.82,35.91 45.82,35.91 46.4,35.34 R1.2 ; U2.1 6.62,14.17 6.62,22.67 9.06,25.11 9.06,34 R2.2 10.56,34.5 v1(11.4,35.34)
  Bottom Layer w0.5: v1(11.4,35.34) v1(12.9,36.84)
$1N2448: length 34.4
  Bottom Layer w0.5: 7.57,31.79 6.16,30.38 5.66,30.38 4.66,29.38 4.66,23.67 6.66,21.67 6.66,11.67 U2.2 ; 7.57,31.79 7.07,32.29 7.07,35.79 7.97,36.69 R4.2 ; 7.57,31.79 R3.2
$1N2454: length 63.5
  Top Layer w0.5: LED1.2 73.52,29.64 67.51,29.64 v1(66.51,30.64) ; 15.59,38.07 17.09,36.57 49.09,36.57 v1(49.59,36.07)
  Bottom Layer w0.5: v1(66.51,30.64) 61.09,36.07 v1(49.59,36.07)
$1N2831: length 29.9
  Top Layer w0.5: J1.1 J1.2 9.04,3.95 9.04,10.94 7.4,12.58 7.4,21.58 11.9,26.08 D1.2
$1N3869: length 5.3
  Bottom Layer w0.5: J4.2 4.95,60.02 J5.2
$1N3874: length 5.3
  Bottom Layer w0.5: J4.1 7.49,60.02 J5.3
$1N4294: length 5.3
  Bottom Layer w0.5: R5.2 90.31,20.25 Q1.2
$1N4302: length 10.3
  Bottom Layer w0.5: 88.25,7.23 88.25,15.64 Q1.3

## Text on the board
Top Silkscreen Layer: 24电信2班何凡
